# EAGLE design Circuito (EAGLE 9.6.2)
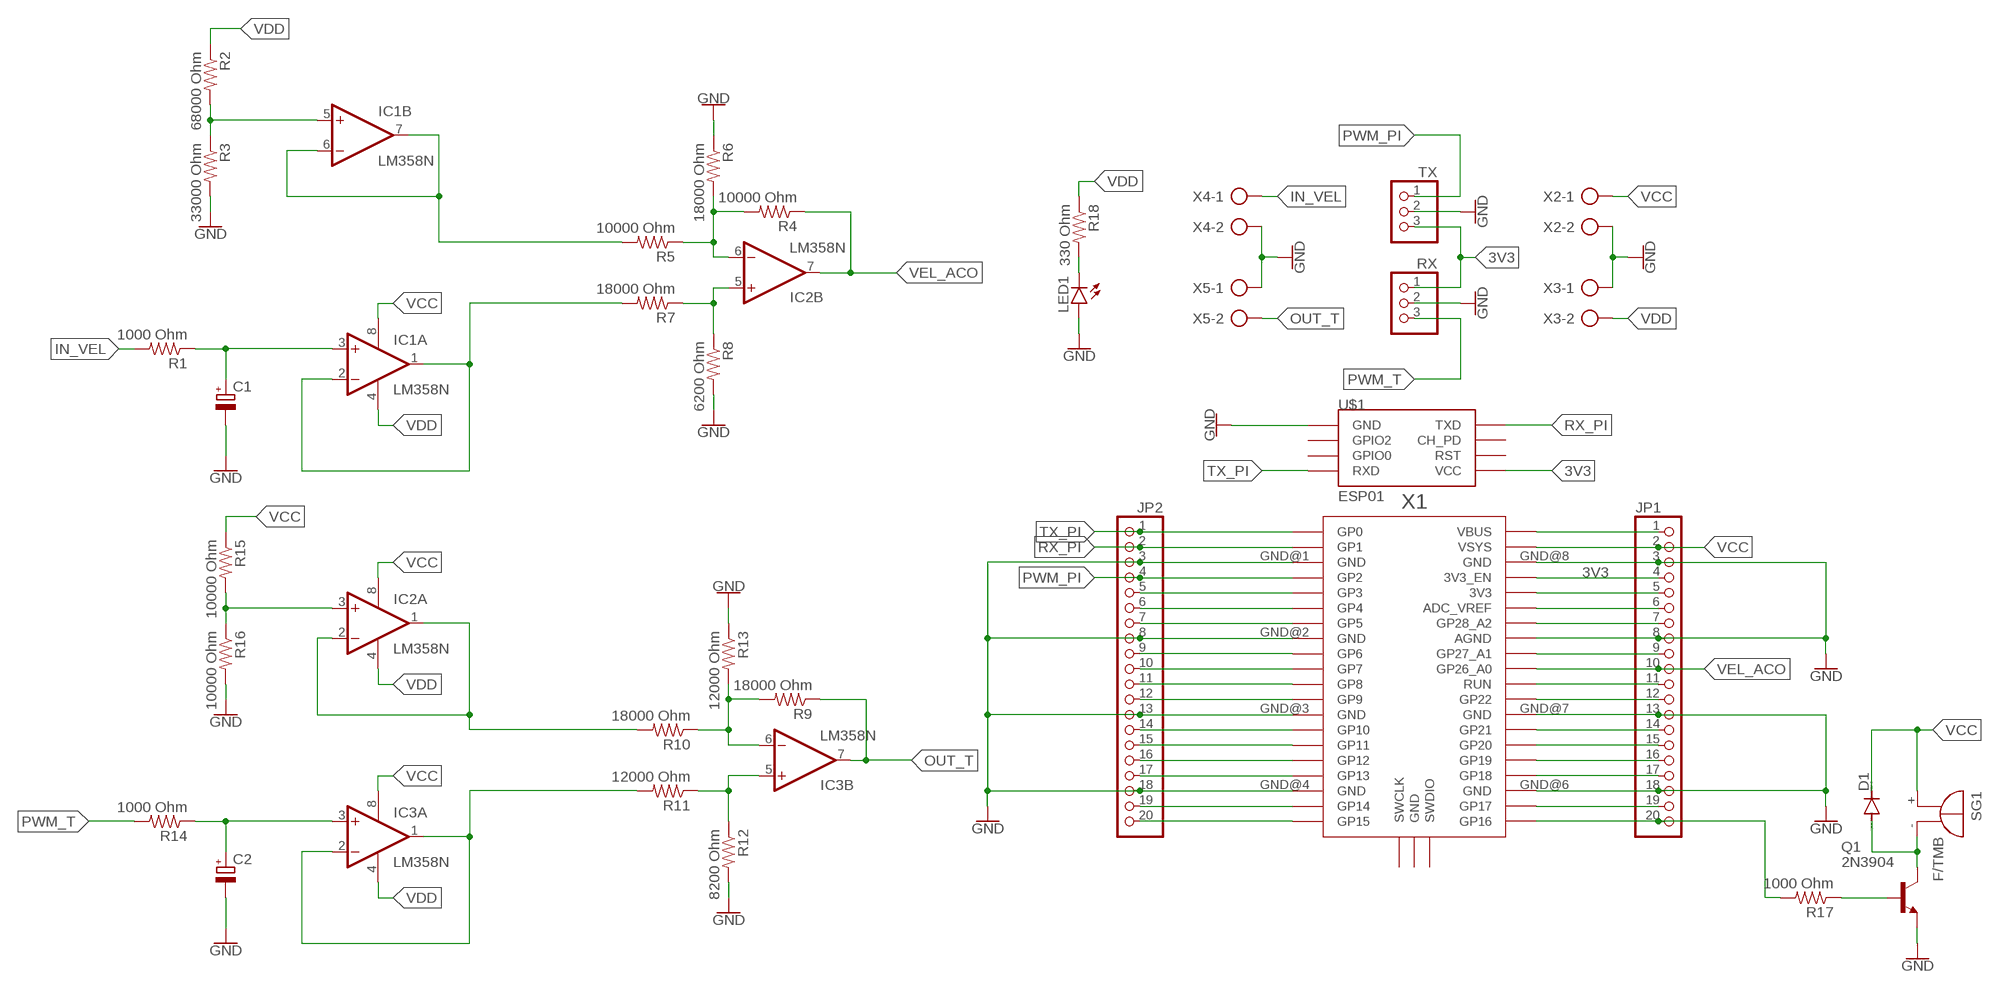
[diagram p0: schematic, sheet 1]

## Parts
C1  CPOL-EUE2.5-6  [E2,5-6]
C2  CPOL-EUE2.5-6  [E2,5-6]
D1  DIODE-DO15-12  [DO15-12]
IC1  LM358N  [DIL08]
IC2  LM358N  [DIL08]
IC3  LM358N  [DIL08]
JP1  PINHD-1X20  [1X20]
JP2  PINHD-1X20  [1X20]
LED1  LED3MM  [LED3MM]
Q1  2N3904  [TO92]
R1  1000 Ohm  R-US_0207/10  [0207/10]
R2  68000 Ohm  R-US_0207/10  [0207/10]
R3  33000 Ohm  R-US_0207/10  [0207/10]
R4  10000 Ohm  R-US_0207/10  [0207/10]
R5  10000 Ohm  R-US_0207/10  [0207/10]
R6  18000 Ohm  R-US_0207/10  [0207/10]
R7  18000 Ohm  R-US_0207/10  [0207/10]
R8  6200 Ohm  R-US_0207/10  [0207/10]
R9  18000 Ohm  R-US_0207/10  [0207/10]
R10  18000 Ohm  R-US_0207/10  [0207/10]
R11  12000 Ohm  R-US_0207/10  [0207/10]
R12  8200 Ohm  R-US_0207/10  [0207/10]
R13  12000 Ohm  R-US_0207/10  [0207/10]
R14  1000 Ohm  R-US_0207/10  [0207/10]
R15  10000 Ohm  R-US_0207/10  [0207/10]
R16  10000 Ohm  R-US_0207/10  [0207/10]
R17  1000 Ohm  R-US_0207/10  [0207/10]
R18  330 Ohm  R-US_0207/10  [0207/10]
RX  PINHD-1X3  [1X03]
SG1  F/TMB  [F/TMB]
TX  PINHD-1X3  [1X03]
U$1  ESP01  [ESP01]
X1  RPI_PICO_IG-TH  [RPI_PICO_TH]
X2  AK500/2  [AK500/2]
X3  AK500/2  [AK500/2]
X4  AK500/2  [AK500/2]
X5  AK500/2  [AK500/2]

## Nets
3V3: JP1.4 RX.1 TX.3 U$1.VCC X1.3V3_EN
GND: C1.- C2.- JP1.3 JP1.8 JP1.13 JP1.18 JP2.3 JP2.8 JP2.13 JP2.18 LED1.A Q1.3(E) R3.2 R6.1 R8.2 R12.2 R13.1 R16.2 RX.2 TX.2 U$1.GND X1.AGND X1.GND@1(GND) X1.GND@2(GND) X1.GND@3(GND) X1.GND@4(GND) X1.GND@6(GND) X1.GND@7(GND) X1.GND@8(GND) X2.2 X3.1 X4.2 X5.1
IN_VEL: R1.2 X4.1
N$1: JP1.1 X1.VBUS
N$2: LED1.K(C) R18.2
N$3: C1.+ IC1.3(A:+IN) R1.1
N$4: JP1.5 X1.3V3
N$5: D1.A Q1.1(C) SG1.-
N$6: JP1.6 X1.ADC_VREF
N$7: JP1.7 X1.GP28_A2
N$8: IC1.1(A:OUT) IC1.2(A:-IN) R7.2
N$9: JP1.9 X1.GP27_A1
N$10: JP1.11 X1.RUN
N$11: JP1.12 X1.GP22
N$12: IC1.6(B:-IN) IC1.7(B:OUT) R5.2
N$13: JP1.14 X1.GP21
N$14: JP1.15 X1.GP20
N$15: JP1.16 X1.GP19
N$16: JP1.17 X1.GP18
N$17: JP1.19 X1.GP17
N$18: JP1.20 R17.2 X1.GP16
N$19: IC1.5(B:+IN) R2.2 R3.1
N$20: IC2.6(B:-IN) R4.2 R5.1 R6.2
N$21: IC3.1(A:OUT) IC3.2(A:-IN) R11.2
N$22: IC2.5(B:+IN) R7.1 R8.1
N$23: JP2.5 X1.GP3
N$24: JP2.6 X1.GP4
N$25: JP2.7 X1.GP5
N$26: IC3.6(B:-IN) R9.2 R10.1 R13.2
N$27: JP2.9 X1.GP6
N$28: JP2.10 X1.GP7
N$29: JP2.11 X1.GP8
N$30: JP2.12 X1.GP9
N$31: C2.+ IC3.3(A:+IN) R14.1
N$32: JP2.14 X1.GP10
N$33: JP2.15 X1.GP11
N$34: JP2.16 X1.GP12
N$35: JP2.17 X1.GP13
N$36: IC3.5(B:+IN) R11.1 R12.1
N$37: JP2.19 X1.GP14
N$38: JP2.20 X1.GP15
N$39: IC2.1(A:OUT) IC2.2(A:-IN) R10.2
N$40: IC2.3(A:+IN) R15.2 R16.1
N$41: Q1.2(B) R17.1
OUT_T: IC3.7(B:OUT) R9.1 X5.2
PWM_PI: JP2.4 TX.1 X1.GP2
PWM_T: R14.2 RX.3
RX_PI: JP2.2 U$1.TX(TXD) X1.GP1
TX_PI: JP2.1 U$1.RX(RXD) X1.GP0
VCC: D1.C IC1.8(P:V+) IC2.8(P:V+) IC3.8(P:V+) JP1.2 R15.1 SG1.+ X1.VSYS X2.1
VDD [New Class]: IC1.4(P:V-) IC2.4(P:V-) IC3.4(P:V-) R2.1 R18.1 X3.2
VEL_ACO: IC2.7(B:OUT) JP1.10 R4.1 X1.GP26_A0
Unconnected: U$1.CH_PD U$1.GPIO0 U$1.GPIO2 U$1.RST X1.GND@5(GND) X1.SWCLK X1.SWDIO

## Library data of the parts
C1 C2 = rcl:CPOL-EU: POLARIZED CAPACITOR, European symbol; SPICEPREFIX: C
D1 = diode:DIODE-: DIODE
IC1-IC3 = linear:LM358: OP AMP also LM158; LM258; LM2904 Source: http://cache.national.com/ds/LM/LM158.pdf
JP1 JP2 = pinhead:PINHD-1X20: PIN HEADER
LED1 = led:LED: LED OSRAM: - CHIPLED LG R971, LG N971, LY N971, LG Q971, LY Q971, LO R971, LY R971 LH N974, LH R974 LS Q976, LO Q976, LY Q976 LO Q996 - Hyper CHIPLED LW Q18S LB Q993, LB Q99A, LB R99A - SideLED LS A670, LO A670, LY A670, LG A670, LP A670 LB A673, LV A673, LT A673, LW A673 LH A674 LY A675 LS A676, LA A676, LO A676, LY A676, LW A676 LS A679, LY A679, LG A679 - Hyper Micro SIDELED® LS Y876, LA Y876, LO Y876, LY Y876 LT Y87S - SmartLED LW L88C, LW L88S LB L89C, LB L89S, LG L890 LS L89K, LO L89K, LY L89K LS L896, LA L896, LO L896, LY L896 - TOPLED LS T670, LO T670, LY T670, LG T670, LP T670 LSG T670, LSP T670, LSY T670, LOP T670, LYG T670 LG T671, LOG T671, LSG T671 LB T673, LV T673, LT T673, LW T673 LH T674 LS T676, LA T676, LO T676, LY T676, LB T676, LH T676, LSB T676, LW T676 LB T67C, LV T67C, LT T67C, LS T67K, LO T67K, LY T67K, LW E67C LS E67B, LA E67B, LO E67B, LY E67B, LB E67C, LV E67C, LT E67C LW T67C LS T679, LY T679, LG T679 LS T770, LO T770, LY T770, LG T770, LP T770 LB T773, LV T773, LT T773, LW T773 LH T774 LS E675, LA E675, LY E675, LS T675 LS T776, LA T776, LO T776, LY T776, LB T776 LHGB T686 LT T68C, LB T68C - Hyper Mini TOPLED® LB M676 - Mini TOPLED Santana® LG M470 LS M47K, LO M47K, LY M47K Source: http://www.osram.convergy.de LUXEON: - LUMILED® LXK2-PW12-R00, LXK2-PW12-S00, LXK2-PW14-U00, LXK2-PW14-V00 LXK2-PM12-R00, LXK2-PM12-S00, LXK2-PM14-U00 LXK2-PE12-Q00, LXK2-PE12-R00, LXK2-PE12-S00, LXK2-PE14-T00, LXK2-PE14-U00 LXK2-PB12-K00, LXK2-PB12-L00, LXK2-PB12-M00, LXK2-PB14-N00, LXK2-PB14-P00, LXK2-PB14-Q00 LXK2-PR12-L00, LXK2-PR12-M00, LXK2-PR14-Q00, LXK2-PR14-R00 LXK2-PD12-Q00, LXK2-PD12-R00, LXK2-PD12-S00 LXK2-PH12-R00, LXK2-PH12-S00 LXK2-PL12-P00, LXK2-PL12-Q00, LXK2-PL12-R00 Source: www.luxeon.com KINGBRIGHT: KA-3528ASYC Source: www.kingbright.com
Q1 = transistor-npn:2N3904: NPN Transistor
R1-R18 = rcl:R-US_: RESISTOR, American symbol; SPICEPREFIX: R
RX TX = pinhead:PINHD-1X3: PIN HEADER
SG1 = buzzer:F/TMB: BUZZER Source: Buerklin; OC_FARNELL: unknown; OC_NEWARK: unknown
U$1 = esp8266modules:ESP01: ESP8266 Wifi module 01
X1 = RaspberryPi_Pico:RPI_PICO_IG
X2-X5 = con-ptr500:AK500/2: CONNECTOR; OC_FARNELL: unknown; OC_NEWARK: unknown

## Board
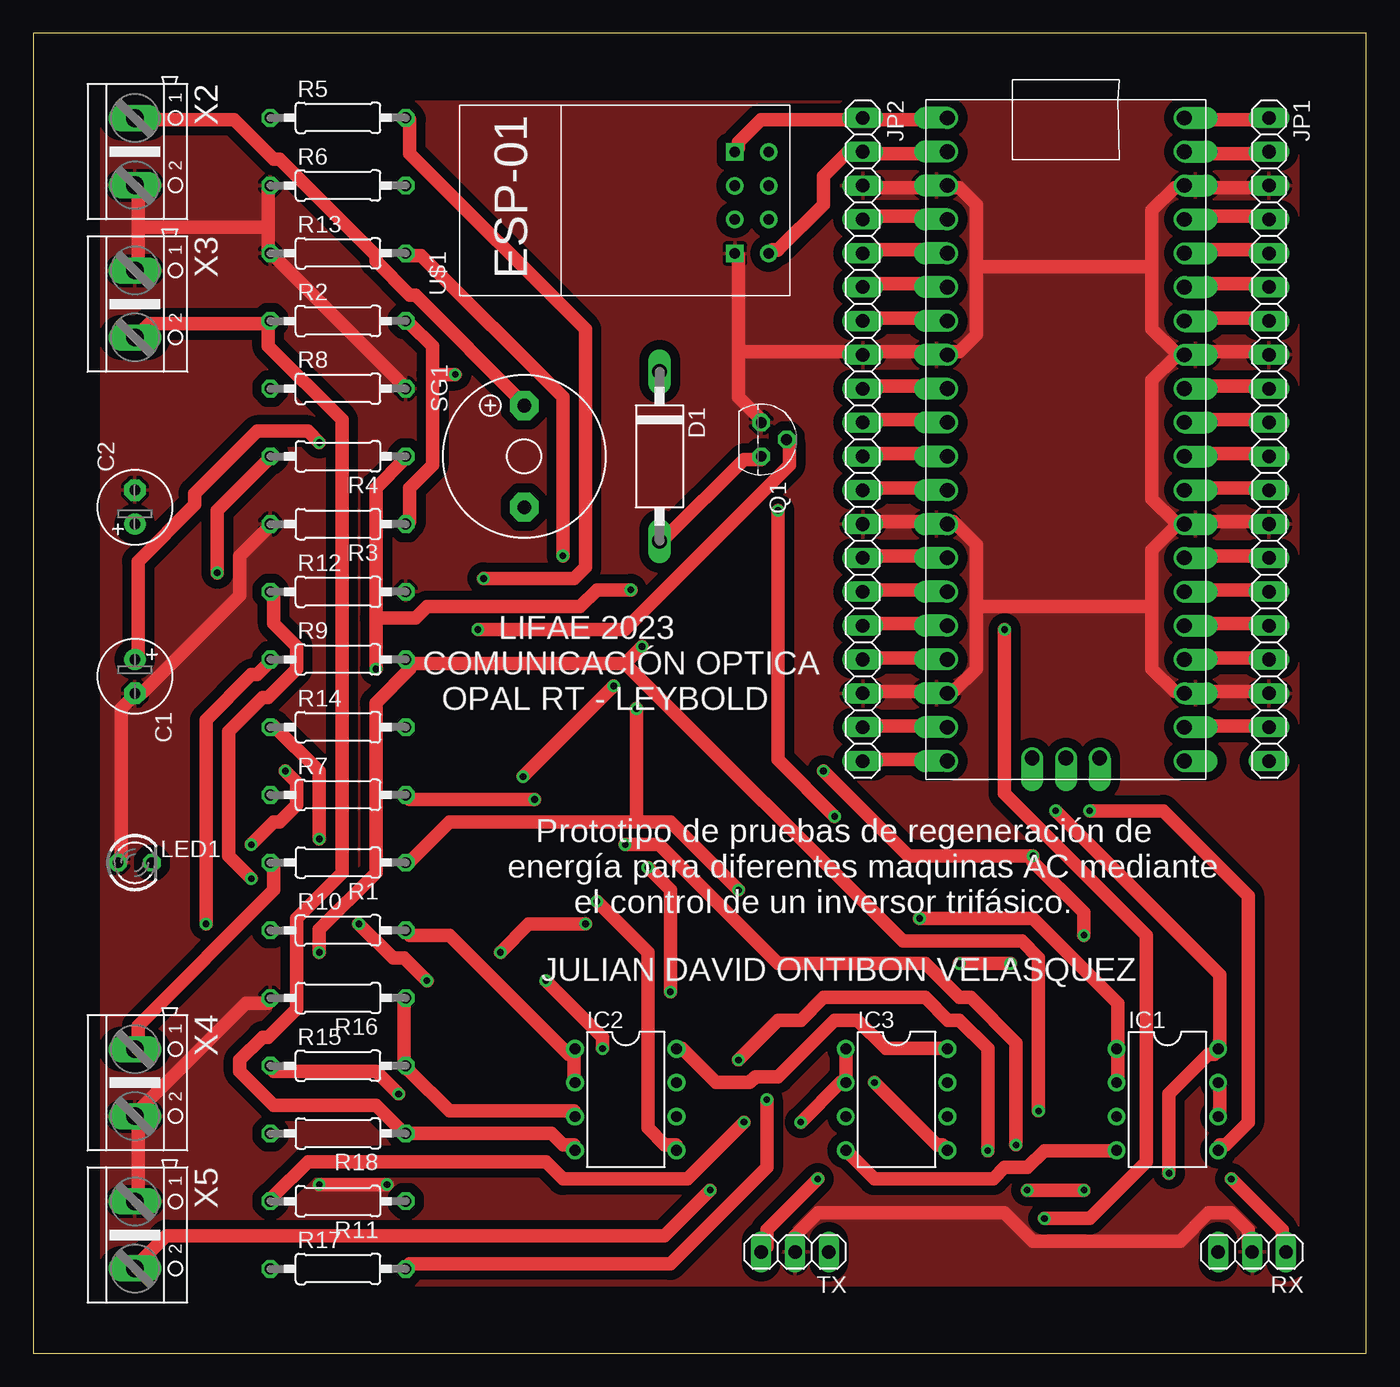
[diagram p1: board, top side]
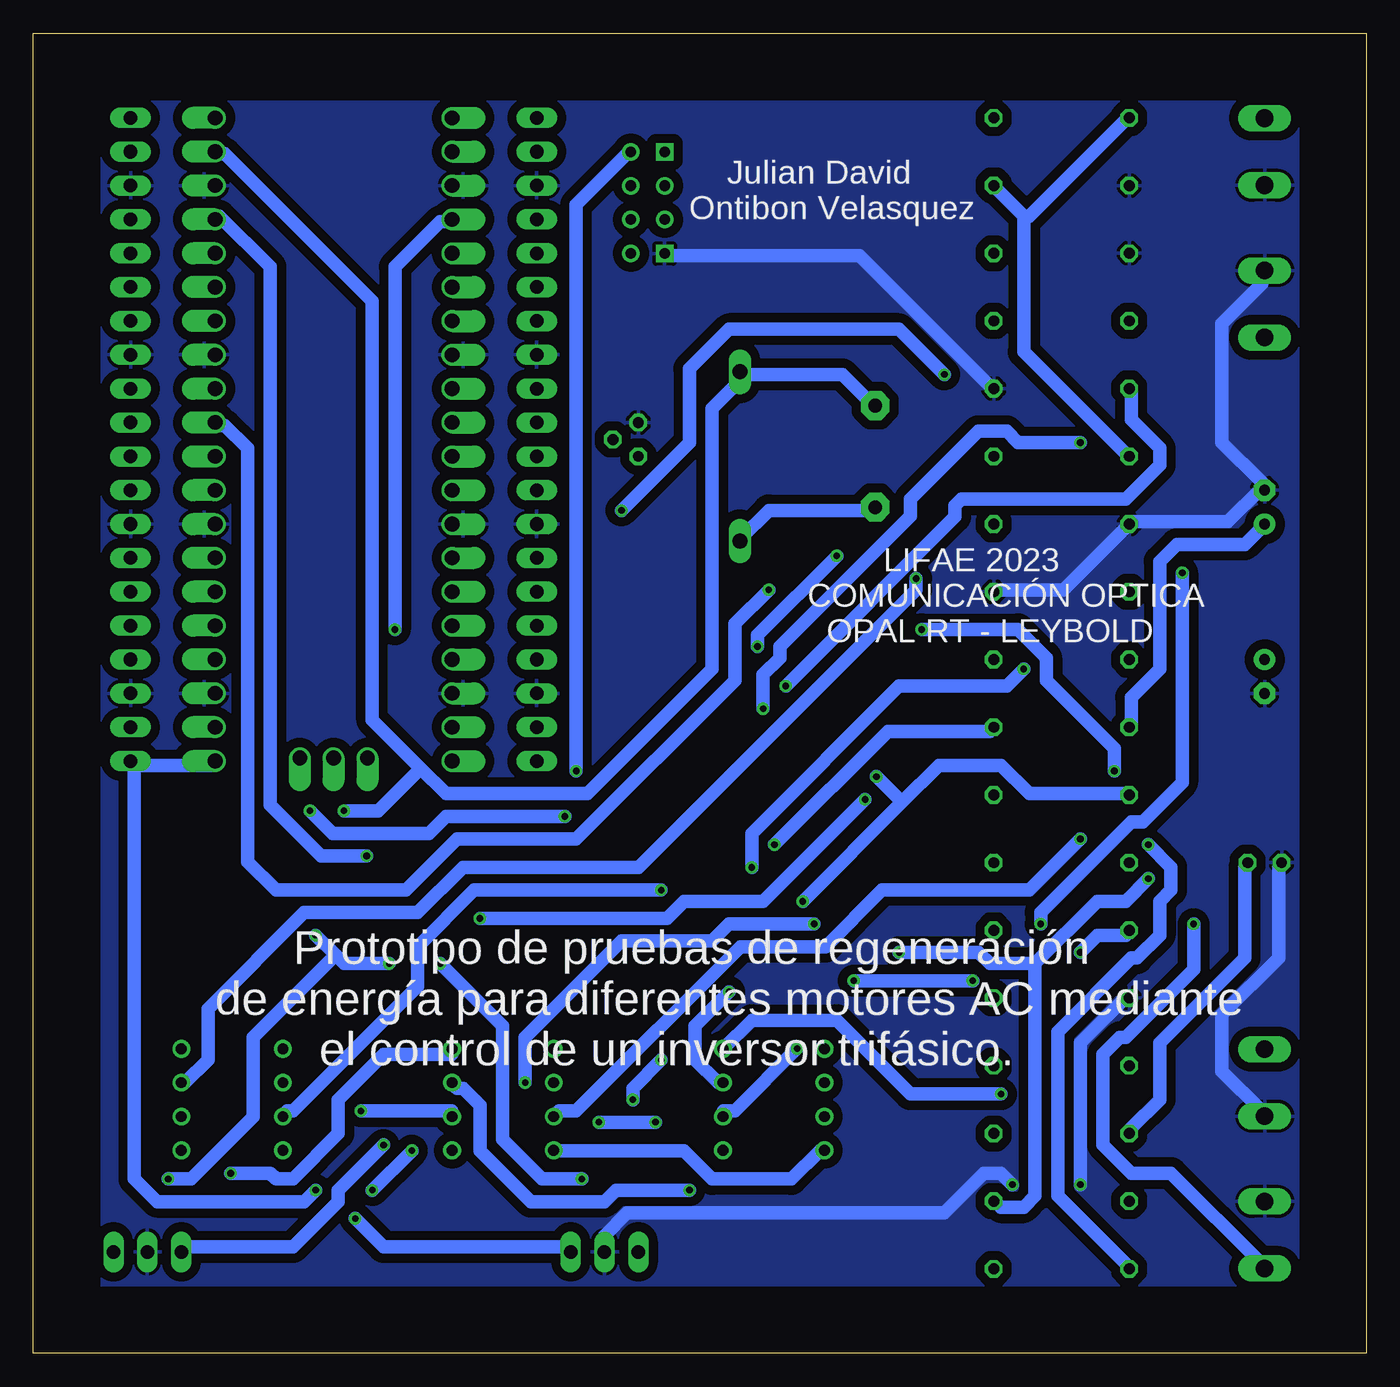
[diagram p2: board, bottom side, seen from below]

Size 100 x 99.05 mm. Coordinates in mm from the lower left corner, seen from the top.
Outline: 0,0 100,0 100,99.05 0,99.05 0,0
Copper layers (1*16): Top 0.035mm / dielectric 1.5mm / Bottom 0.035mm
Design rules "ReglasBase": minimum track width 1mm, minimum drill 0.5mm, track to track 0.7mm, track to pad 0.7mm, pad to pad 0.7mm, via to via 0.7mm, smd to smd 6mil, copper to edge 5mm, drill to drill 6mil, minimum pad ring 10mil, minimum via ring 8mil, stop-mask expansion 4mil, vias tented up to drill 0mil, thermal gap 10mil

### Footprints (pad centres in the part's own frame; a part is rotated, then mirrored left to right if it is on the bottom)
E2,5-6 = drill 0.813 pad 1.6: + -1.27,0 | drill 0.813 pad 1.6 octagon: - 1.27,0
DO15-12 = drill 1.118 long: A 6.35,0; C -6.35,0
DIL08 = drill 0.813 pad 1.27: 1 -3.81,-3.81; 2 -1.27,-3.81; 3 1.27,-3.81; 4 3.81,-3.81; 5 3.81,3.81; 6 1.27,3.81; 7 -1.27,3.81; 8 -3.81,3.81
1X20 = drill 1.016 long: 1 -24.13,0; 2 -21.59,0; 3 -19.05,0; 4 -16.51,0; 5 -13.97,0; 6 -11.43,0; 7 -8.89,0; 8 -6.35,0; 9 -3.81,0; 10 -1.27,0; 11 1.27,0; 12 3.81,0; 13 6.35,0; 14 8.89,0; 15 11.43,0; 16 13.97,0; 17 16.51,0; 18 19.05,0; 19 21.59,0; 20 24.13,0
LED3MM = drill 0.813 octagon: A -1.27,0; K 1.27,0
TO92 = drill 0.813 octagon: 1 1.27,0; 2 0,1.905; 3 -1.27,0
0207/10 = drill 0.813 octagon: 1 -5.08,0; 2 5.08,0
1X03 = drill 1.016 long: 1 -2.54,0; 2 0,0; 3 2.54,0
F/TMB = drill 1.016 pad 2.159 octagon: + 3.81,0; - -3.81,0
ESP01 = drill 0.8: CH_PD -1.285,-8.178; GPIO0 1.255,-5.638; GPIO2 -1.285,-5.638; RST 1.255,-8.178; TX -3.825,-8.178; VCC 3.795,-8.178 | drill 0.8 square: GND -3.825,-5.638; RX 3.795,-5.638
RPI_PICO_TH = drill 1.1 pad 1.6 offset: 3V3 8.89,13.97; 3V3_EN 8.89,16.51; ADC_VREF 8.89,11.43; AGND 8.89,6.35; GND@1 -8.89,19.05; GND@2 -8.89,6.35; GND@3 -8.89,-6.35; GND@4 -8.89,-19.05; GND@5 0,-23.9; GND@6 8.89,-19.05; GND@7 8.89,-6.35; GND@8 8.89,19.05; GP0 -8.89,24.13; GP1 -8.89,21.59; GP2 -8.89,16.51; GP3 -8.89,13.97; GP4 -8.89,11.43; GP5 -8.89,8.89; GP6 -8.89,3.81; GP7 -8.89,1.27; GP8 -8.89,-1.27; GP9 -8.89,-3.81; GP10 -8.89,-8.89; GP11 -8.89,-11.43; GP12 -8.89,-13.97; GP13 -8.89,-16.51; GP14 -8.89,-21.59; GP15 -8.89,-24.13; GP16 8.89,-24.13; GP17 8.89,-21.59; GP18 8.89,-16.51; GP19 8.89,-13.97; GP20 8.89,-11.43; GP21 8.89,-8.89; GP22 8.89,-3.81; GP26_A0 8.89,1.27; GP27_A1 8.89,3.81; GP28_A2 8.89,8.89; RUN 8.89,-1.27; SWCLK -2.54,-23.9; SWDIO 2.54,-23.9; VBUS 8.89,24.13; VSYS 8.89,21.59
AK500/2 = drill 1.321 long: 1 -2.515,0; 2 2.515,0

### Placement (x,y rotation side)
C1  7.62,50.8 270 top
C2  7.62,63.5 90 top
D1  46.99,67.31 270 top
IC1  85.09,19.05 270 top
IC2  44.45,19.05 270 top
IC3  64.77,19.05 270 top
JP1  92.71,68.58 270 top
JP2  62.23,68.58 270 top
LED1  7.62,36.83 0 top
Q1  54.61,68.58 270 top
R1  22.86,36.83 180 top
R2  22.86,77.47 0 top
R3  22.86,62.23 180 top
R4  22.86,67.31 180 top
R5  22.86,92.71 0 top
R6  22.86,87.63 0 top
R7  22.86,41.91 0 top
R8  22.86,72.39 0 top
R9  22.86,52.07 0 top
R10  22.86,31.75 0 top
R11  22.86,11.43 180 top
R12  22.86,57.15 0 top
R13  22.86,82.55 0 top
R14  22.86,46.99 0 top
R15  22.86,21.59 0 top
R16  22.86,26.67 180 top
R17  22.86,6.35 0 top
R18  22.86,16.51 180 top
RX  91.44,7.62 180 top
SG1  36.83,67.31 90 top
TX  57.15,7.62 180 top
U$1  46.99,86.36 90 top
X1  77.47,68.58 0 top
X2  7.62,90.17 270 top
X3  7.62,78.74 270 top
X4  7.62,20.32 270 top
X5  7.62,8.89 270 top

### Tracks (layer width: path | path; a pad name or v marks a point on that pad's centre or on a via)
3V3  (via drill 0.5)
  Top 1: v59.28,43.7 65.65,37.33 v75,37.33 75,36.9 78.83,33.08 v78.83,31.38 | v58.85,13.1 55.03,9.28 55.03,8 TX.3 | v73.3,29.25 v69.48,29.25 | JP1.4 92.42,85.35 86.48,85.35 X1.3V3_EN | v89.88,13.1 93.7,9.28 93.7,8 RX.1
  Bottom 1: v59.28,43.7 59.28,86.2 55.45,90.02 U$1.VCC | v75,37.33 78.4,37.33 82.23,41.15 82.23,81.53 86.05,85.35 X1.3V3_EN | v58.85,13.1 61.83,13.1 64.8,16.07 64.8,24.58 v69.48,29.25 | v73.3,29.25 76.7,29.25 77.34,29.89 | v78.83,31.38 77.34,29.89 | v89.88,13.1 88.17,13.1 83.5,17.78 83.5,23.73 77.34,29.89
GND  (via drill 0.5)
  Top 1: JP2.3 62.25,87.47 68.2,87.47 X1.GND@1 69.05,87.47 69.48,87.47 70.75,86.2 70.75,81.53 | 52.9,75.15 52.9,71.75 54.6,70.05 Q1.3 | 52.9,75.15 52.9,82.38 U$1.GND | 52.9,75.15 61.83,75.15 JP2.8 62.25,75.15 68.2,75.15 X1.GND@2 68.62,75.15 69.48,75.15 70.75,76.42 70.75,81.53 | JP2.18 62.25,49.65 68.2,49.65 X1.GND@4 69.05,49.65 70.75,51.35 70.75,56.03 | JP2.13 62.25,62.4 68.2,62.4 X1.GND@3 69.05,62.4 70.75,60.7 70.75,56.03 | JP1.3 92.42,87.47 86.48,87.47 X1.GND@8 86.05,87.47 85.63,87.47 83.92,85.77 83.92,81.53 | JP1.8 92.42,75.15 86.48,75.15 X1.AGND | JP1.18 92.42,49.65 86.48,49.65 X1.GND@6 86.05,49.65 85.63,49.65 83.92,51.35 83.92,56.03 | JP1.13 92.42,62.4 86.48,62.4 X1.GND@7 | 83.92,56.03 83.92,60.28 86.05,62.4 X1.GND@7 | X1.AGND 86.05,74.72 85.63,74.72 83.92,73.03 83.92,64.1 85.63,62.4 X1.GND@7 | 83.92,81.53 83.92,76.85 85.63,75.15 X1.AGND | 83.92,56.03 70.75,56.03 | 83.92,81.53 70.75,81.53 | 7.85,84.5 7.85,87.47 X2.2 | 7.85,84.5 7.85,81.53 X3.1 | 17.62,84.5 17.62,87.47 R6.1 | 17.62,84.5 17.62,82.8 R13.1 18.05,82.38 27.83,72.6 R8.2 | 17.62,84.5 7.85,84.5 | TX.2 57.15,8.85 58.85,10.55 72.88,10.55 75,8.43 86.05,8.43 88.17,10.55 89.88,10.55 91.15,9.28 91.15,8 RX.2 | R16.2 17.62,26.27 15.92,26.27 7.85,18.2 X4.2 7.85,17.35 7.85,11.83 X5.1 | LED1.A 6.58,36.9 6.58,48.38 7.43,49.23 C1.- 7.85,49.65 8.28,49.65 15.5,56.88 15.5,59.85 17.62,61.97 R3.2 | v21.45,12.68 v26.55,12.68
  Bottom 1: R12.2 27.83,57.3 22.73,57.3 18.05,61.97 R3.2 17.62,62.4 10.4,62.4 7.85,64.95 C2.- 7.85,65.38 10.83,68.35 10.83,77.28 7.85,80.25 7.85,81.1 X3.1 | X4.2 7.85,18.2 10.83,21.18 10.83,25.43 6.58,29.68 6.58,36.48 LED1.A | TX.2 57.15,8.85 55.45,10.55 31.65,10.55 28.67,13.53 27.4,13.53 v26.55,12.68 | v21.45,12.68 21.45,23.3 18.05,26.7 R16.2 | U$1.GND 52.48,82.38 38.03,82.38 28.25,72.6 R8.2
  pour Bottom: 1.27,97.79 1.27,1.27 99.06,1.27 99.06,97.79
  pour Top: 2.54,96.52 97.79,96.52 97.79,1.27 3.81,1.27 0,5.08 0,93.98
IN_VEL
  Top 1: R1.2 18.05,36.48 18.05,34.77 7.85,24.58 7.85,22.88 X4.1
N$1
  Top 1: JP1.1 92.42,92.58 86.48,92.58 X1.VBUS
N$2
  Bottom 1: LED1.K 9.12,36.48 9.12,29.68 15.5,23.3 15.5,19.05 17.62,16.93 R18.2
N$3  (via drill 0.5)
  Top 1: v52.9,34.77 47.8,39.88 45.25,39.88 | 45.25,39.88 31.23,39.88 28.25,36.9 R1.1 | v21.45,68.35 20.6,69.2 16.78,69.2 12.1,64.53 12.1,63.67 7.85,59.42 7.85,52.2 C1.+ | 45.25,39.88 v45.25,48.38
  Bottom 1: v52.9,34.77 66.92,34.77 71.17,30.52 71.17,27.55 80.52,18.2 80.95,18.2 IC1.3 | v21.45,68.35 26.12,68.35 26.98,69.2 29.1,69.2 34.2,64.1 34.2,62.83 43.98,53.05 43.98,52.2 45.25,50.92 v45.25,48.38
N$4
  Top 1: JP1.5 92.42,82.8 86.48,82.8 X1.3V3
N$5
  Top 1: Q1.1 54.6,67.08 53.33,67.08 47.38,61.12 D1.A
  Bottom 1: SG1.- 37.17,63.25 44.83,63.25 46.95,61.12 D1.A
N$6
  Top 1: JP1.6 92.42,80.25 86.48,80.25 X1.ADC_VREF
N$7
  Top 1: JP1.7 92.42,77.7 86.48,77.7 X1.GP28_A2
N$8  (via drill 0.5)
  Top 1: IC1.2 81.38,20.32 81.38,22.45 IC1.1 81.38,23.3 81.38,26.27 75,32.65 v66.5,32.65 | v37.6,41.58 28.25,41.58 R7.2
  Bottom 1: v37.6,41.58 45.25,33.92 51.2,33.92 52.48,32.65 v66.5,32.65
N$9
  Top 1: JP1.9 92.42,72.6 86.48,72.6 X1.GP27_A1
N$10
  Top 1: JP1.11 92.42,67.5 86.48,67.5 X1.RUN
N$11
  Top 1: JP1.12 92.42,64.95 86.48,64.95 X1.GP22
N$12  (via drill 0.5)
  Top 1: IC1.6 89.02,18.2 89.02,19.9 IC1.7 | v33.78,58.15 40.58,58.15 41.42,59 41.42,76.85 28.25,90.02 28.25,92.58 R5.2
  Bottom 1: v33.78,58.15 33.78,57.3 54.6,36.48 67.78,36.48 71.17,33.08 79.67,33.08 86.9,25.85 86.9,22.03 88.6,20.32 IC1.7
N$13
  Top 1: JP1.14 92.42,59.85 86.48,59.85 X1.GP21
N$14
  Top 1: JP1.15 92.42,57.3 86.48,57.3 X1.GP20
N$15
  Top 1: JP1.16 92.42,54.75 86.48,54.75 X1.GP19
N$16
  Top 1: JP1.17 92.42,52.2 86.48,52.2 X1.GP18
N$17
  Top 1: JP1.19 92.42,47.1 86.48,47.1 X1.GP17
N$18  (via drill 0.5)
  Top 1: v55.03,19.05 55.03,13.95 47.8,6.73 28.25,6.73 R17.2 | v52.9,22.03 55.88,25 57.58,25 59.28,26.7 66.92,26.7 68.62,25 69.48,25 71.6,22.88 v71.6,15.23 | v78.83,12.25 v74.58,12.25
  Bottom 1: v55.03,19.05 55.03,19.9 v52.9,22.03 | v74.58,12.25 v71.6,15.23 | v78.83,12.25 79.67,11.4 90.73,11.4 92.42,13.1 92.42,44.12 JP1.20 92,44.12 86.48,44.12 X1.GP16
N$19  (via drill 0.5)
  Top 1: 29.95,73.45 29.95,75.58 28.25,77.28 R2.2 | 29.95,73.45 29.95,66.65 28.25,64.95 28.25,62.4 R3.1 | v79.25,40.73 84.77,40.73 91.15,34.35 91.15,17.35 89.45,15.65 89.02,15.65 IC1.5 | v60.12,40.3 55.88,44.55 v55.88,63.25 | 29.95,73.45 v31.65,73.45
  Bottom 1: v79.25,40.73 77.55,39.03 70.33,39.03 69.05,40.3 v60.12,40.3 | v55.88,63.25 50.78,68.35 50.78,73.88 47.8,76.85 35.05,76.85 v31.65,73.45
N$20  (via drill 0.5)
  Top 1: v42.7,22.88 42.7,23.73 v38.45,27.98 | v29.53,27.98 27.83,29.68 26.98,29.68 v24.42,32.23 | v13.8,58.58 13.8,63.25 17.62,67.08 R4.2
  Bottom 1: 25.7,85.35 25.7,75.15 18.05,67.5 R4.2 | 25.7,85.35 27.83,87.47 R6.2 | v42.7,22.88 47.38,18.2 48.23,18.2 IC2.6 | v29.53,27.98 v38.45,27.98 | v24.42,32.23 24.42,33.08 17.62,39.88 16.78,39.88 13.8,42.85 v13.8,58.58 | R5.1 18.05,92.58 25.28,85.35 25.7,85.35
N$21  (via drill 0.5)
  Top 1: v53.33,17.35 49.08,13.1 39.73,13.1 38.45,14.38 20.6,14.38 18.05,11.83 R11.2 | v57.58,17.35 60.55,20.32 IC3.2 60.98,20.75 60.98,22.45 IC3.1
  Bottom 1: v57.58,17.35 v53.33,17.35
N$22  (via drill 0.5)
  Top 1: v42.28,33.92 46.1,30.1 46.1,16.93 47.38,15.65 48.23,15.65 IC2.5 | v36.75,43.28 v43.55,50.08
  Bottom 1: v42.28,33.92 34.84,41.36 | 34.84,41.36 32.08,44.12 27.4,44.12 25.28,42 18.05,42 R7.1 | v43.55,50.08 30.84,62.78 30.84,63.63 30.38,64.1 18.05,64.1 15.5,66.65 15.5,67.92 17.62,70.05 17.62,72.17 R8.1 | 34.84,41.36 v36.75,43.28
N$23
  Top 1: JP2.5 62.25,82.8 68.2,82.8 X1.GP3
N$24
  Top 1: JP2.6 62.25,80.25 68.2,80.25 X1.GP4
N$25
  Top 1: JP2.7 62.25,77.7 68.2,77.7 X1.GP5
N$26  (via drill 0.5)
  Top 1: v75.42,18.2 75.42,29.68 74.15,30.95 65.23,30.95 44.4,51.78 | 28.25,51.78 44.4,51.78 | 28.25,51.78 R9.2 | v21.45,30.1 21.45,31.8 25.7,36.05 25.7,48.8 28.25,51.35 28.25,51.78 | v39.73,59.85 39.73,71.75 29.1,82.38 28.25,82.38 R13.2 | 44.4,51.78 v45.67,53.05
  Bottom 1: v75.42,18.2 68.62,18.2 IC3.6 | v21.45,30.1 20.17,31.38 18.05,31.38 R10.1 | v39.73,59.85 45.67,53.9 v45.67,53.05
N$27
  Top 1: JP2.9 62.25,72.6 68.2,72.6 X1.GP6
N$28
  Top 1: JP2.10 62.25,70.05 68.2,70.05 X1.GP7
N$29
  Top 1: JP2.11 62.25,67.5 68.2,67.5 X1.GP8
N$30
  Top 1: JP2.12 62.25,64.95 68.2,64.95 X1.GP9
N$31  (via drill 0.5)
  Top 1: v21.45,38.6 21.45,43.7 18.05,47.1 R14.1
  Bottom 1: R14.1 17.62,47.1 17.62,49.23 15.5,51.35 15.5,59.42 14.23,60.7 9.12,60.7 7.85,61.97 C2.+ | v21.45,38.6 25.28,34.77 36.33,34.77 40.58,30.52 46.95,30.52 59.28,18.2 60.55,18.2 IC3.3
N$32
  Top 1: JP2.14 62.25,59.85 68.2,59.85 X1.GP10
N$33
  Top 1: JP2.15 62.25,57.3 68.2,57.3 X1.GP11
N$34
  Top 1: JP2.16 62.25,54.75 68.2,54.75 X1.GP12
N$35
  Top 1: JP2.17 62.25,52.2 68.2,52.2 X1.GP13
N$36  (via drill 0.5)
  Top 1: v16.35,35.62 14.65,37.33 14.65,46.67 17.2,49.23 17.62,49.23 19.75,51.35 19.75,53.05 18.05,54.75 18.05,56.88 R12.1 | v63.1,20.32 67.78,15.65 68.2,15.65 IC3.5 | v41.42,32.23 37.17,32.23 v35.05,30.1
  Bottom 1: v16.35,35.62 18.05,33.92 20.17,33.92 24.85,29.25 | 24.85,29.25 24.85,11.83 25.7,10.98 27.4,10.98 27.83,11.4 R11.1 | v63.1,20.32 63.1,23.73 55.88,30.95 49.08,30.95 47.8,32.23 v41.42,32.23 | v35.05,30.1 29.1,30.1 28.25,29.25 24.85,29.25
N$37
  Top 1: JP2.19 62.25,47.1 68.2,47.1 X1.GP14
N$38
  Top 1: JP2.20 62.25,44.55 68.2,44.55 X1.GP15
N$39
  Top 1: IC2.2 40.58,20.32 40.58,22.45 IC2.1 40.15,22.45 31.23,31.38 28.25,31.38 R10.2
N$40
  Top 1: R16.1 27.83,26.27 27.83,21.6 R15.2 28.25,21.18 31.23,18.2 40.58,18.2 IC2.3
N$41  (via drill 0.5)
  Top 1: v16.35,38.17 18.05,39.88 18.48,39.88 19.75,41.15 19.75,42.85 v18.9,43.7 | v33.35,54.33 44.4,54.33 56.73,66.65 56.73,68.35 Q1.2
  Bottom 1: v16.35,38.17 14.65,36.48 14.65,34.77 15.5,33.92 15.5,31.38 17.2,29.68 17.62,29.68 23.15,24.15 23.15,11.83 18.05,6.73 R17.1 | v18.9,43.7 18.9,45.4 24,50.5 24,52.2 26.12,54.33 v33.35,54.33
OUT_T  (via drill 0.5)
  Top 1: v50.78,12.25 47.38,8.85 9.98,8.85 7.85,6.73 X5.2 | v12.95,32.23 12.95,47.53 16.35,50.92 16.78,50.92 17.62,51.78 R9.1
  Bottom 1: v50.78,12.25 56.3,12.25 57.15,11.4 62.67,11.4 66.5,15.23 66.5,18.62 67.78,19.9 68.2,19.9 IC3.7 | v12.95,32.23 12.95,28.83 18.05,23.73 18.48,23.73 19.75,22.45 19.75,15.65 17.62,13.53 14.65,13.53 7.85,6.73 X5.2
PWM_PI  (via drill 0.5)
  Top 1: v75.85,10.12 79.25,10.12 83.5,14.38 83.5,31.38 72.88,42 v72.88,54.33 | JP2.4 62.25,85.35 68.2,85.35 X1.GP2
  Bottom 1: v75.85,10.12 73.73,8 59.7,8 TX.1 | v72.88,54.33 72.88,81.53 69.48,84.92 68.62,84.92 X1.GP2
PWM_T  (via drill 0.5)
  Top 1: v44.4,38.17 46.95,38.17 55.88,29.25 66.92,29.25 69.48,26.7 70.33,26.7 73.73,23.3 v73.73,15.65
  Bottom 1: v44.4,38.17 35.9,46.67 28.25,46.67 R14.2 | v73.73,15.65 77.12,12.25 77.12,11.4 80.52,8 88.6,8 RX.3
RX_PI
  Top 1: U$1.TX 55.45,82.8 55.88,82.8 59.28,86.2 59.28,88.33 60.98,90.02 61.83,90.02 JP2.2 62.67,90.02 68.2,90.02 X1.GP1
TX_PI
  Top 1: U$1.RX 52.9,90.45 52.9,90.88 54.6,92.58 61.83,92.58 JP2.1 62.67,92.58 68.2,92.58 X1.GP0
VCC  (via drill 0.5)
  Top 1: v27.4,19.48 25.7,21.18 18.05,21.18 R15.1 | IC3.8 68.2,22.88 63.95,22.88 61.83,25 60.12,25 55.88,20.75 54.17,20.75 53.75,20.32 51.2,20.32 48.65,22.88 IC2.8 | v85.2,13.53 85.2,19.48 88.17,22.45 88.6,22.45 IC1.8 89.02,23.3 89.02,28.4 v76.7,40.73 | JP1.2 92.42,90.02 86.48,90.02 X1.VSYS | X2.1 7.85,92.58 15.08,92.58 18.05,89.6 18.48,89.6 25.7,82.38 25.7,81.95 28.25,79.4 28.67,79.4 36.75,71.33 SG1.+
  Bottom 1: v27.4,19.48 34.2,19.48 39.73,25 46.1,25 48.23,22.88 IC2.8 | v85.2,13.53 82.23,13.53 81.8,13.1 80.52,13.1 77.12,16.5 77.12,19.05 73.73,22.45 68.62,22.45 IC3.8 | SG1.+ 37.17,71.33 39.3,73.45 46.95,73.45 D1.C 46.95,73.03 49.08,70.9 49.08,51.35 58.42,42 69.05,42 70.96,43.91 | 70.96,43.91 74.58,47.53 74.58,78.97 85.63,90.02 86.05,90.02 X1.VSYS | v76.7,40.73 74.15,40.73 70.96,43.91
VDD
  Top 1: X3.2 7.85,76.42 8.7,77.28 17.62,77.28 R2.1 17.62,76.85 17.62,75.58 23.15,70.05 23.15,36.05 19.75,32.65 19.75,25.85 17.62,23.73 17.2,23.73 15.5,22.03 15.5,21.18 18.05,18.62 25.7,18.62 27.83,16.5 R18.1 28.25,16.5 38.88,16.5 39.73,15.65 40.58,15.65 IC2.4 | IC3.4 63.1,13.1 72.03,13.1 72.88,13.95 74.58,13.95 75.85,15.23 80.95,15.23 IC1.4
  Bottom 1: IC3.4 60.55,15.23 51.2,15.23 49.08,13.1 43.12,13.1 41,15.23 IC2.4
VEL_ACO  (via drill 0.5)
  Top 1: JP1.10 92.42,70.05 86.48,70.05 X1.GP26_A0 | v47.8,27.12 47.8,34.77 v46.1,36.48 | 25.7,55.17 25.7,64.95 27.83,67.08 R4.1 | 25.7,55.17 v25.7,51.35 | v44.83,57.3 42.28,57.3 41,56.03 29.53,56.03 28.67,55.17 25.7,55.17
  Bottom 1: v47.8,27.12 50.35,24.58 50.35,22.03 48.65,20.32 IC2.7 | v46.1,36.48 46.1,39.03 35.05,50.08 26.98,50.08 v25.7,51.35 | v44.83,57.3 47.38,54.75 47.38,50.5 59.28,38.6 68.2,38.6 72.03,34.77 81.8,34.77 83.92,36.9 83.92,67.92 85.63,69.62 86.05,69.62 X1.GP26_A0

### Text on the board
tPlace: LIFAE 2023 / COMUNICACIÓN OPTICA / OPAL RT - LEYBOLD | Prototipo de pruebas de regeneración de / energía para diferentes maquinas AC mediante / el control de un inversor trifásico. | JULIAN DAVID ONTIBON VELASQUEZ
bPlace: Julian David / Ontibon Velasquez | LIFAE 2023 / COMUNICACIÓN OPTICA / OPAL RT - LEYBOLD | Prototipo de pruebas de regeneración / de energía para diferentes motores AC mediante / el control de un inversor trifásico.